# Altium project single_coil_driver.PrjPcb
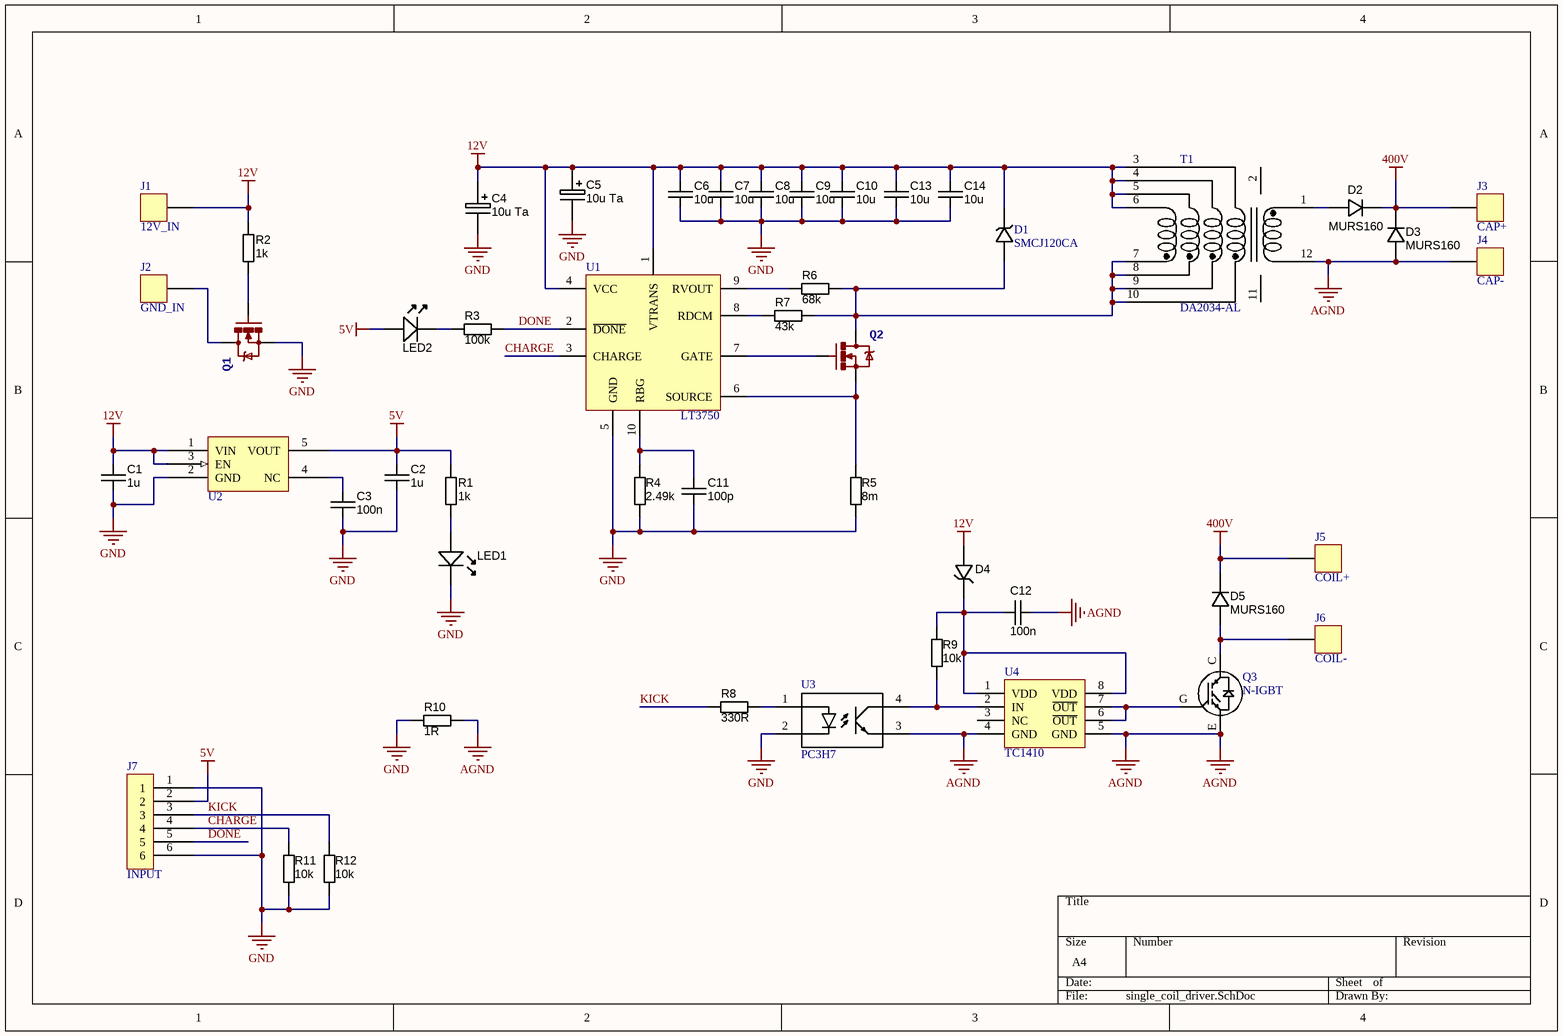
[diagram p0: single_coil_driver.SchDoc]
1 sheet, 48 parts. Net scope: global (net labels, ports and power ports of the same name join across sheets).
Board file: single_coil_driver.PcbDoc

## Sheet single_coil_driver.SchDoc
size A4

### Parts
C1  1u  [CAPC3216X180N]
C2  1u  [CAPC3216X180N]
C3  100n  [CAPC1608X90N]
C4  10u Ta  [CAPMP3528X210N]
C5  10u Ta  [CAPMP3528X210N]
C6  10u  [CAPC3216X180N]
C7  10u  [CAPC3216X180N]
C8  10u  [CAPC3216X180N]
C9  10u  [CAPC3216X180N]
C10  10u  [CAPC3216X180N]
C11  100p  [CAPC1608X90N]
C12  100n  [CAPC1608X90N]
C13  10u  [CAPC3216X180N]
C14  10u  [CAPC3216X180N]
D1  SMCJ120CA  [DO-214AB]
D2  MURS160  [DO-214AA]
D3  MURS160  [DO-214AA]
D4  (no value)  [SOD123]
D5  MURS160  [DO-214AA]
J1  12V_IN  [MEDIUM-POWER-VIA]
J2  GND_IN  [MEDIUM-POWER-VIA]
J3  CAP+  [MEDIUM-POWER-VIA]
J4  CAP-  [MEDIUM-POWER-VIA]
J5  COIL+  [MEDIUM-POWER-VIA]
J6  COIL-  [MEDIUM-POWER-VIA]
J7  INPUT  [MICRO-MATCH-6]
LED1  Green  [LED-0603-GREEN]  (value not drawn)
LED2  Green  [LED-0603-GREEN]  (value not drawn)
Q1  MOSFET-N  [SOT669]  (value not drawn)
Q2  MOSFET-N  [SOT669]  (value not drawn)
Q3  N-IGBT  [TO-247]
R1  1k  [RESC1608X55N]
R2  1k  [RESC1608X55N]
R3  100k  [RESC1608X55N]
R4  2.49k  [RESC1608X55N]
R5  8m  [RESC5025X70N]
R6  68k  [RESC1608X55N]
R7  43k  [RESC1608X55N]
R8  330R  [RESC1608X55N]
R9  10k  [RESC1608X55N]
R10  1R  [RESC1608X55N]
R11  10k  [RESC1608X55N]
R12  10k  [RESC1608X55N]
T1  DA2034-AL  [DA2034-AL]
U1  LT3750  [MSOP-10]
U2  LDO-SOT23-5  [SOT23-5]  (value not drawn)
U3  PC3H7  [SOIC127P680X230-4M]
U4  TC1410  [SO8]

### Nets
5V: C2.1 J7.2 LED2.A R1.1 U2.5(VOUT)
12V: C1.1 C4.1 C5.1 C6.1 C7.1 C8.1 C9.1 C10.1 C13.1 C14.1 D1.1 D4.A J1.1 R2.1 T1.3 T1.4 T1.5 T1.6 U1.1(VTRANS) U1.4(VCC) U2.1(VIN) U2.3(EN)
400V: D2.K D3.K D5.K J3.1 J5.1
AGND: C12.2 D3.A J4.1 Q3.E R10.1 T1.12 U3.3 U4.4(GND) U4.5(GND)
GND: C1.2 C2.2 C3.2 C4.2 C5.2 C6.2 C7.2 C8.2 C9.2 C10.2 C11.2 C13.2 C14.2 J7.1 J7.6 LED1.K Q1.S R4.1 R5.2 R10.2 R11.2 R12.2 U1.5(GND) U2.2(GND) U3.2
CHARGE: J7.4 R11.1 U1.3(CHARGE)
DONE: J7.5 R3.1 U1.2(~{DONE})
KICK: J7.3 R8.2 R12.1
NetC3_1: C3.1 U2.4(NC)
NetC11_1: C11.1 R4.2 U1.10(RBG)
NetC12_1: C12.1 D4.K R9.1 U4.1(VDD) U4.8(VDD)
NetD1_2: D1.2 Q2.D R6.2 R7.2 T1.7 T1.8 T1.9 T1.10
NetD2_A: D2.A T1.1
NetD5_A: D5.A J6.1 Q3.C
NetJ2_1: J2.1 Q1.D
NetLED1_A: LED1.A R1.2
NetLED2_K: LED2.K R3.2
NetQ1_G: Q1.G R2.2
NetQ2_G: Q2.G U1.7(GATE)
NetQ2_S: Q2.S R5.1 U1.6(SOURCE)
NetQ3_G: Q3.G U4.6(~{OUT}) U4.7(~{OUT})
NetR6_1: R6.1 U1.9(RVOUT)
NetR7_1: R7.1 U1.8(RDCM)
NetR8_1: R8.1 U3.1
NetR9_2: R9.2 U3.4 U4.2(IN)

Not connected (* = marked no-connect by the designer): T1 2 11; U4 3(NC)

### Library data of the parts
C1 C2 C6-C10 C13 C14 = CAPC_10u_1206_16V: Capacitor SMD Cer 10uF 10% 16V X7R 1206; Manufacturer 1: Kemet; Manufacturer Part Number 1: C1206C106K4RACTU; Ratings: 16V; X7R; Material: ceramic; SCDType: spec; Value: 10µ; Package / Case: 1206 (3216 metric); Tolerance: ±10%; Supplier 1: Digi-Key; Supplier Part Number 1: 399-3525-1-ND
C3 C11 C12 = CAPC_10n_0603_X7R_50V_10%: Capacitor SMD Cer 10nF 10% 50V X7R 0603; Manufacturer 1: TDK Corporation; Manufacturer Part Number 1: C1608X7R1H103K; Ratings: 50V; X7R; Material: ceramic; SCDType: spec; Value: 10n; Package / Case: 0603 (1608 metric); Tolerance: ±10%; Supplier 1: Digi-Key; Supplier Part Number 1: 445-1311-1-ND; ComponentLink1URL: http://product.tdk.com/capacitor/mlcc/en/documents/mlcc_commercial_general_en.pdf; ComponentLink1Description: http://product.tdk.com/capacitor/mlcc/en/documents/mlcc_commercial_general_en.pdf; Supplier 2: Digi-Key; Supplier Part Number 2: 478-1227-1-ND; Manufacturer 2: AVX Corporation; Manufacturer Part Number 2: 06035C103KAT2A; ComponentLink2URL: http://www.avx.com/docs/Catalogs/cx7r.pdf; ComponentLink2Description: http://www.avx.com/docs/Catalogs/cx7r.pdf
C4 C5 = CAPT_47u_1210_6V3: Capacitor SMD Tantalum 47uF 20% 6.3V 1210; Manufacturer 1: AVX Corporation; Manufacturer Part Number 1: TCJB476M006R0070; Manufacturer Size Code: B; Voltage - Rated: 6V3; ESR (Equivalent Series Resistance): 70.0 mOhm; Type: Molded; Value: 47µ; SCDType: spec; Package / Case: 1210 (3528 Metric); Tolerance: ±20%; Material: Tantalum; Supplier 1: Digi-Key; Supplier Part Number 1: 478-3139-1-ND; Operating Temperature: -55°C ~ 125°C; Size / Dimension: 0.138" L x 0.110" W (3.50mm x 2.80mm); Height - Seated (Max): 0.083" (2.10mm); ComponentLink1URL: http://www.avx.com/docs/Catalogs/tcj.pdf; ComponentLink1Description: http://www.avx.com/docs/Catalogs/tcj.pdf; Ratings: 6.3V
D1 = TVS-DIODE
D2 D3 D5 = DIODE_100V_1.5A_SMA: Diode SMD 100V 1.5A SMA; Manufacturer 1: Diodes Inc; Manufacturer Part Number 1: S2BA-13-F; Ratings: 100V; 1.5A; Material: Si; Diode Type: Standard; Value: Vf = 1.15V @ 1.5A (Max); SCDType: source; Package / Case: DO-214AC, SMA; Supplier 1: Digi-Key; Supplier Part Number 1: S2BA-FDICT-ND
D4 = DIODE_ZENER_28V_500mW: Diode Zener SMD 28V 0.5W SOD-123; Manufacturer 1: ON Semiconductor; Manufacturer Part Number 1: MMSZ5255BT1G; Ratings: 28V; 0.5W; Material: Si; Tolerance: ±5%; SCDType: source; Package / Case: SOD-123; Diode Type: Zener; Supplier 1: Digi-Key; Supplier Part Number 1: MMSZ5255BT1GOSCT-ND
J1-J6 = HEADER-1
J7 = HEADER-6
LED1 LED2 = LED_SMD_Green_0603_525nm_350mcd: LED 0603 SMD Green 525nm 350mcd 20mA; Manufacturer 1: Kingbright; Manufacturer Part Number 1: APT1608ZGCK; Material: InGaN; Ratings: 200mcd min; 350 mcd typ @ 20mA; Voltage - Forward (Vf) @ 10mA: 3.1V; Viewing Angle: 120°; Lens Style/Size: Rectangle with Flat Top, 1.2mm x 0.8mm; Voltage - Forward (Vf) @ 20mA: 3.3V; SCDType: source; Package / Case: 0603 (1608 metric); Color: Green; Current - Test: 20mA; Manufacturer 2: Kingbright Company LLC; Manufacturer Part Number 2: APT1608-WAP24; Supplier 1: Mouser; Supplier Part Number 1: 604-APT1608ZGCK; ComponentLink1URL: http://www.mouser.com/ds/2/216/APT1608ZGCK-262051.pdf; ComponentLink1Description: http://www.mouser.com/ds/2/216/APT1608ZGCK-262051.pdf; ComponentLink2Description: APT1608-WAP24 Datasheet; ComponentLink2URL: \\SVFI2\PBLShare\Eng\Electrical Engineering\Hardware\Altium\Libraries and Templates\Unreleased Components\Part Number Request 2013-10-02\APT1608-WAP24(Ver.1B).pdf
Q1 Q2 = MOSFET-N: PROD_ID: IC-08089
R1-R4 R6-R12 = RES_1K_0603_1%: Resistor SMD chip 1k Ohm 0.1W 1% 0603; Manufacturer 1: Yageo; Manufacturer Part Number 1: RC0603FR-071KL; Ratings: 1/10W; SCDType: spec; Package / Case: 0603 (1608 Metric); Supplier 1: Digi-Key; Supplier Part Number 1: 311-1.00KHRCT-ND; Tolerance: ±1%; Value: 1K
R5 = RES_10R_2010_5%: Resistor SMD chip 10 Ohm 0.25W 5% 2010; Manufacturer 1: Vishay/Dale; Manufacturer Part Number 1: CRCW120610R0JNEA; Ratings: 1/4W; SCDType: undef; Value: 10R; Package / Case: 2010; Supplier 1: Digi-Key; Supplier Part Number 1: 541-10ECT-ND; ComponentLink1URL: http://www.vishay.com/doc?20035; ComponentLink1Description: http://www.vishay.com/doc?20035; Tolerance: ±5%